# EAGLE board comando 24V (EAGLE 9.6.1), part 1 of 2
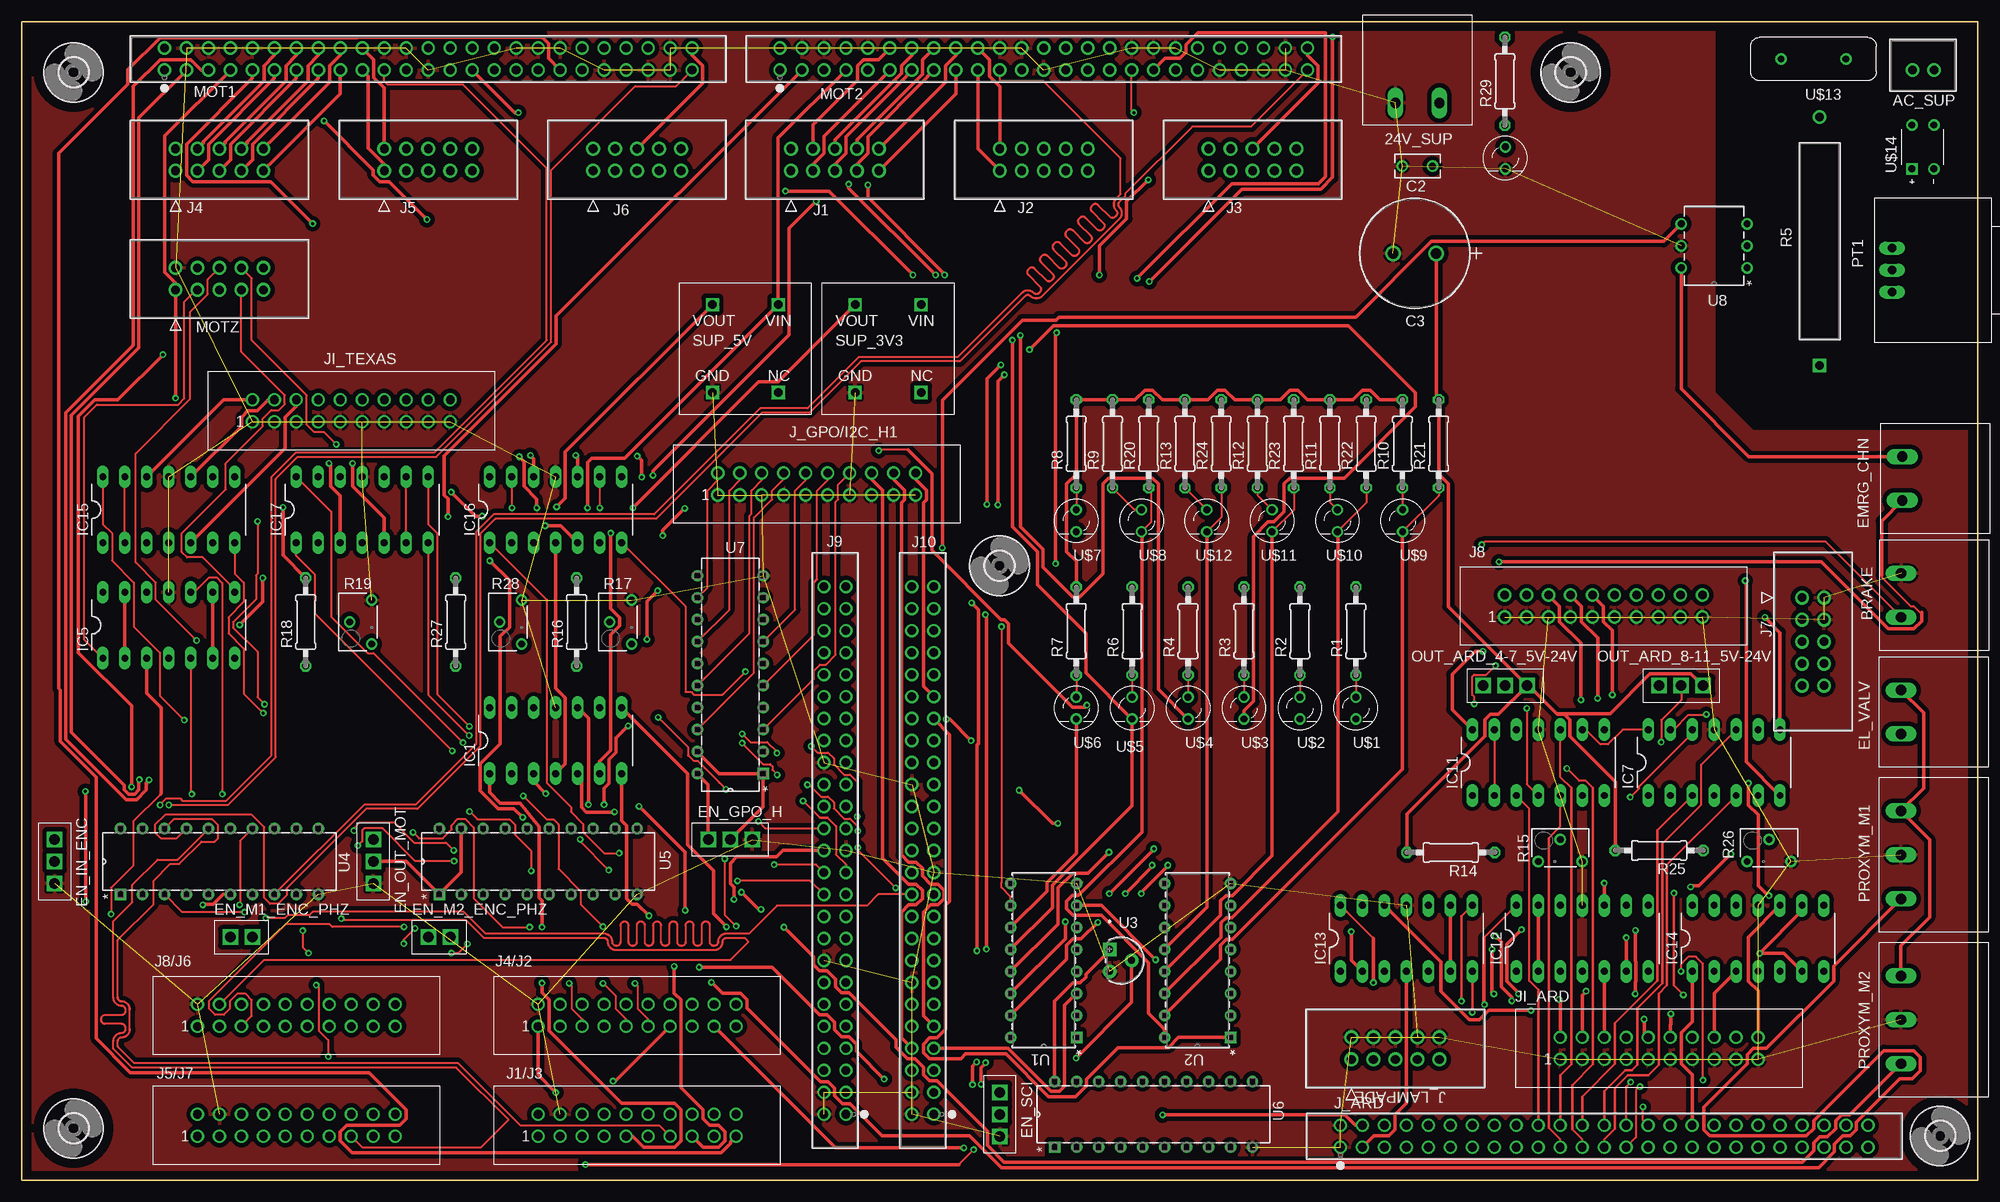
[diagram p13: board, top side]
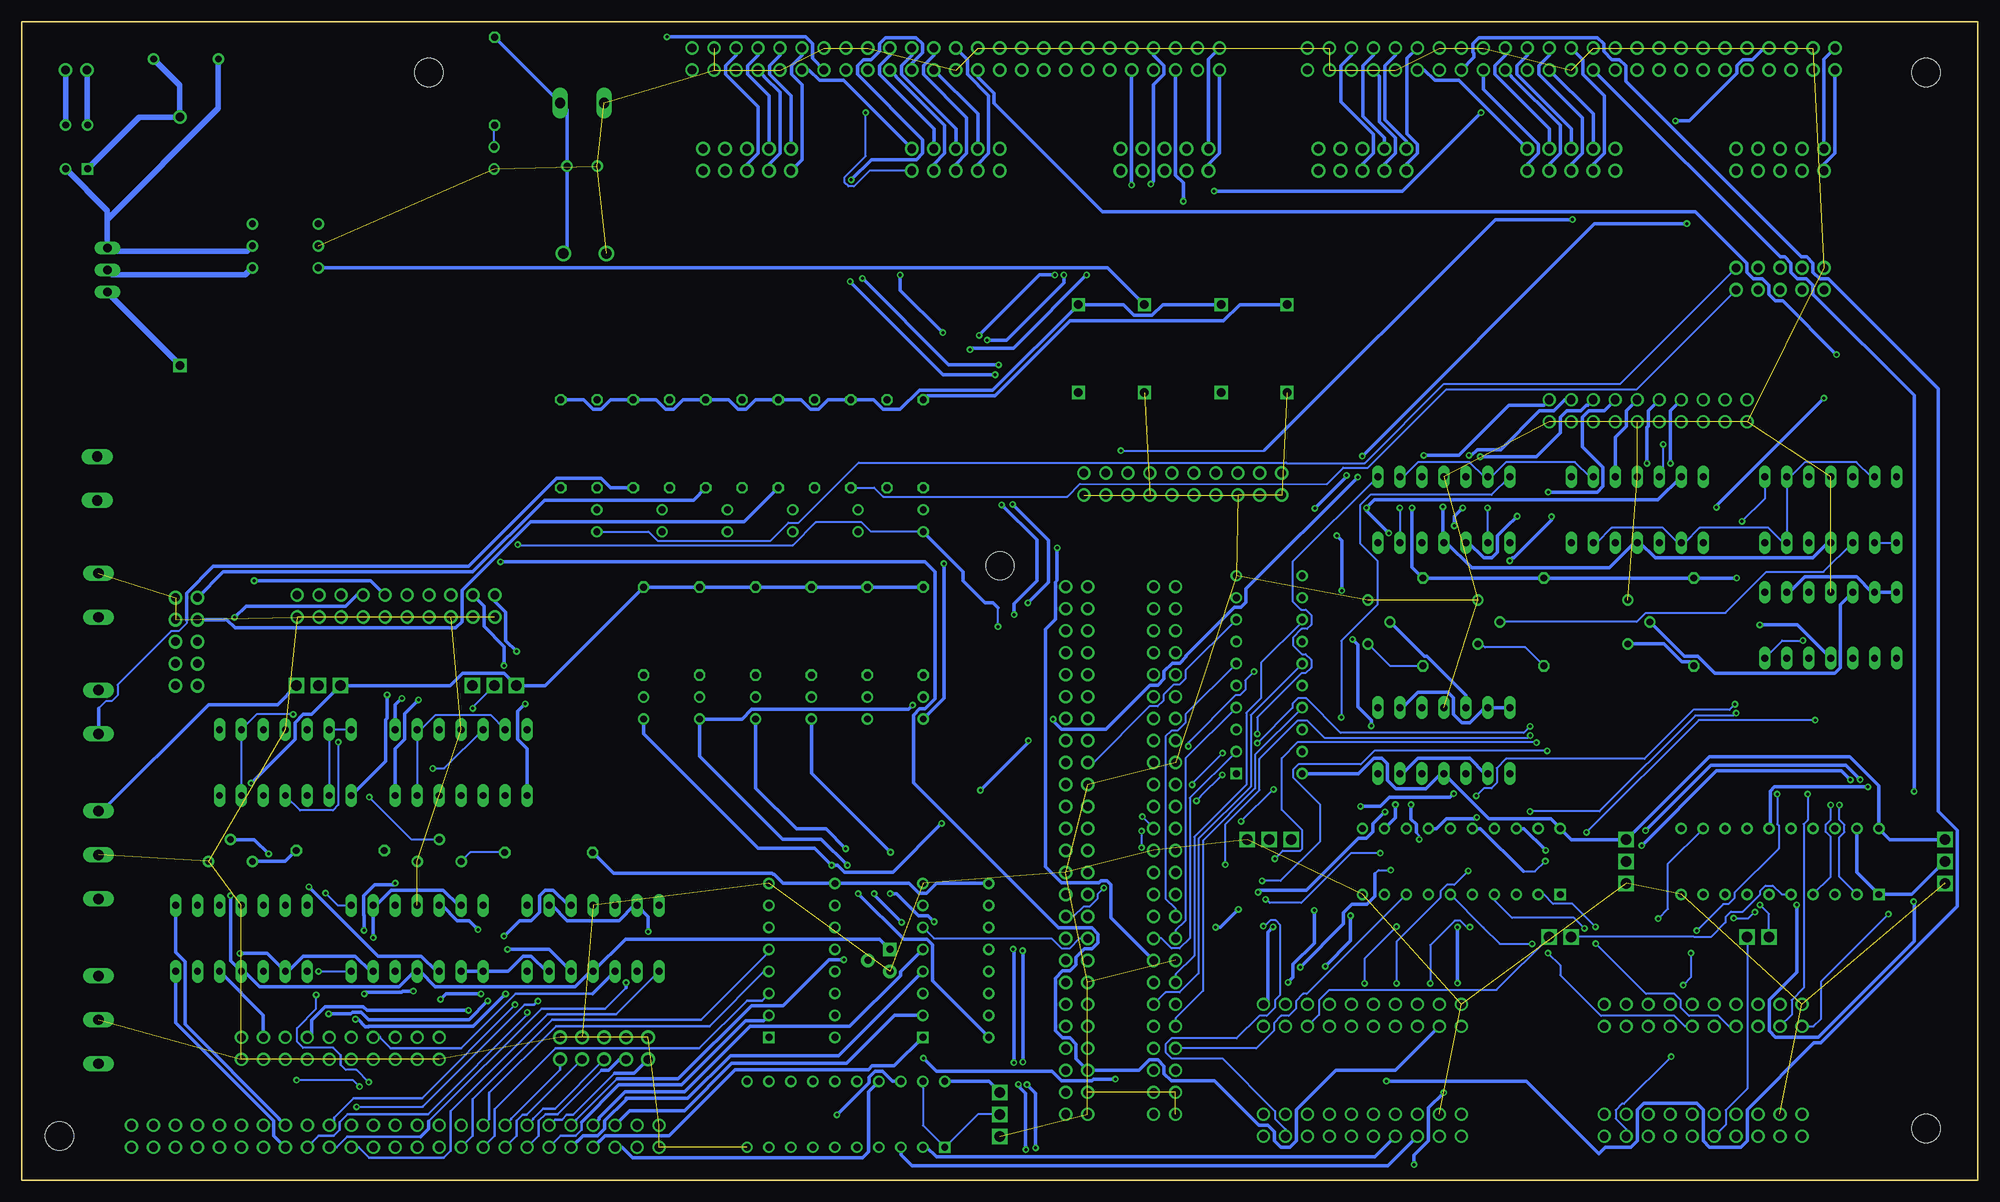
[diagram p14: board, bottom side, seen from below]

Size 226.06 x 133.86 mm. Coordinates in mm from the lower left corner, seen from the top.
Outline: 0,0 226.06,0 226.06,133.86 0,133.86 0,0
Copper layers (1*16): Top 0.035mm / dielectric 1.5mm / Bottom 0.035mm
Design rules "default *": minimum track width 10mil, minimum drill 0.35mm, track to track 10mil, track to pad 10mil, pad to pad 10mil, via to via 10mil, smd to smd 6mil, copper to edge 40mil, drill to drill 10mil, minimum pad ring 10mil, minimum via ring 8mil, stop-mask expansion 4mil, vias tented up to drill 0mil, thermal gap 10mil
Net classes: 0 default: width 0.254 mm, clearance 0.254 mm; 1 supply: width 0.381 mm, clearance 0.254 mm; 2 ground: width 0.381 mm, clearance 0.254 mm; 3 high speed: width 0.254 mm, clearance 0.254 mm; 4 mid speed: width 0.254 mm, clearance 0.254 mm

## Footprints (pad centres in the part's own frame; a part is rotated, then mirrored left to right if it is on the bottom)
CON_2F = drill 1.2 long: 1 0,0; 2 0,-5.08
CONN_B2B-XH-A(LF)(SN)_JST = drill 1 pad 1.549: 1 0,0; 2 -2.489,0
CAP_QYX_2P5X5X8P5_NCH = drill 0.8 pad 1.27: 1 0,0; 2 3.505,0
CAP_UBY_12P5X31P5_NCH = drill 1.2 pad 1.778: 1 0,0; 2 5.004,0
STRIP_3 = drill 1.2 square: 1 0,0; 2 2.54,0; 3 5.08,0
STRIP_2 = drill 1.2 square: 1 0,0; 2 2.54,0
DIL14 = drill 0.8 long: 1 -7.62,-3.81; 2 -5.08,-3.81; 3 -2.54,-3.81; 4 0,-3.81; 5 2.54,-3.81; 6 5.08,-3.81; 7 7.62,-3.81; 8 7.62,3.81; 9 5.08,3.81; 10 2.54,3.81; 11 0,3.81; 12 -2.54,3.81; 13 -5.08,3.81; 14 -7.62,3.81
CONN_61201021621_WRE = drill 1 pad 1.6: 1 0,0; 2 0,-2.54; 3 -2.54,0; 4 -2.54,-2.54; 5 -5.08,0; 6 -5.08,-2.54; 7 -7.62,0; 8 -7.62,-2.54; 9 -10.16,0; 10 -10.16,-2.54
61202021621 = drill 1: 1 -11.43,-1.27; 2 -8.89,-1.27; 3 -6.35,-1.27; 4 -3.81,-1.27; 5 -1.27,-1.27; 6 1.27,-1.27; 7 3.81,-1.27; 8 6.35,-1.27; 9 8.89,-1.27; 10 11.43,-1.27; 11 -11.43,1.27; 12 -8.89,1.27; 13 -6.35,1.27; 14 -3.81,1.27; 15 -1.27,1.27; 16 1.27,1.27; 17 3.81,1.27; 18 6.35,1.27; 19 8.89,1.27; 20 11.43,1.27
CONN_SBH11-PBPC-D25-ST-BK_SUL = drill 1 pad 1.524: 1 0,0; 2 0,2.54; 3 2.54,0; 4 2.54,2.54; 5 5.08,0; 6 5.08,2.54; 7 7.62,0; 8 7.62,2.54; 9 10.16,0; 10 10.16,2.54; 11 12.7,0; 12 12.7,2.54; 13 15.24,0; 14 15.24,2.54; 15 17.78,0; 16 17.78,2.54; 17 20.32,0; 18 20.32,2.54; 19 22.86,0; 20 22.86,2.54; 21 25.4,0; 22 25.4,2.54; 23 27.94,0; 24 27.94,2.54; 25 30.48,0; 26 30.48,2.54; 27 33.02,0; 28 33.02,2.54; 29 35.56,0; 30 35.56,2.54; 31 38.1,0; 32 38.1,2.54; 33 40.64,0; 34 40.64,2.54; 35 43.18,0; 36 43.18,2.54; 37 45.72,0; 38 45.72,2.54; 39 48.26,0; 40 48.26,2.54; 41 50.8,0; 42 50.8,2.54; 43 53.34,0; 44 53.34,2.54; 45 55.88,0; 46 55.88,2.54; 47 58.42,0; 48 58.42,2.54; 49 60.96,0; 50 60.96,2.54
CON_3F = drill 1.2 long: 1 0,0; 2 0,-5.08; 3 0,-10.16
POT_2W_5K = drill 1 long: 1 0,2.54; 2 0,0; 3 0,-2.54
0207/10 = drill 0.8 octagon: 1 -5.08,0; 2 5.08,0
RES_OY_OHM = drill 1 pad 1.549 square: 1 0,0 | drill 1 pad 1.549: 2 28.702,0
RES3_64W_TTE = drill 0.8 pad 1.219: 1 0,0; 2 2.54,2.54; 3 5.08,0
BR30X = drill 1 square: GND 0,-10.16; NC 7.62,-10.16; VIN 7.62,0; VOUT 0,0
DIP-16_STM = drill 0.8 pad 1.27 square: 1 0,0 | drill 0.8 pad 1.27: 2 0,-2.54; 3 0,-5.08; 4 0,-7.62; 5 0,-10.16; 6 0,-12.7; 7 0,-15.24; 8 0,-17.78; 9 7.62,-17.78; 10 7.62,-15.24; 11 7.62,-12.7; 12 7.62,-10.16; 13 7.62,-7.62; 14 7.62,-5.08; 15 7.62,-2.54; 16 7.62,0
T_3_ADI = drill 0.8 pad 1.524 square: 1 0,0 | drill 0.8 pad 1.524: 2 1.27,2.54; 3 2.54,0
N20 = drill 0.8 pad 1.295 square: 1 -7.62,22.86 | drill 0.8 pad 1.295: 2 -7.62,20.32; 3 -7.62,17.78; 4 -7.62,15.24; 5 -7.62,12.7; 6 -7.62,10.16; 7 -7.62,7.62; 8 -7.62,5.08; 9 -7.62,2.54; 10 -7.62,0; 11 0,0; 12 0,2.54; 13 0,5.08; 14 0,7.62; 15 0,10.16; 16 0,12.7; 17 0,15.24; 18 0,17.78; 19 0,20.32; 20 0,22.86
PDIP6-646BX_ONS = drill 0.8 pad 1.27: 1 0,0; 2 0,-2.54; 3 0,-5.08; 4 7.62,-5.08; 5 7.62,-2.54; 6 7.62,0
LED_TONDO = drill 0.8: 1 0,1.27; 2 0,-1.27
C0U12F = drill 0.8: P$1 0,0; P$2 7.5,0
DIP508W58P254L483H270Q4 = drill 0.8 square: 1 -2.54,1.27 | drill 0.8: 2 -2.54,-1.27; 3 2.54,-1.27; 4 2.54,1.27
3,3 = hole 3.3: 0,0

## Placement (x,y rotation side)
24V_SUP  CON_2F  [CON_2F]  163.83,124.46 270 top
AC_SUP  B2B-XH-A(LF)(SN)  [CONN_B2B-XH-A(LF)(SN)_JST]  220.98,128.27 0 top
BRAKE  CON_2F  [CON_2F]  217.2,65.05 180 top
C2  QYX1H102JTP3TA  [CAP_QYX_2P5X5X8P5_NCH]  163.04,117.17 180 top
C3  UBY2A301MHL  [CAP_UBY_12P5X31P5_NCH]  163.47,107.09 180 top
EL_VALV  CON_2F  [CON_2F]  217.17,51.56 180 top
EMRG_CHN  CON_2F  [CON_2F]  217.32,78.54 180 top
EN_GPO_H  STRIP_3  [STRIP_3]  79.35,39.37 0 top
EN_IN_ENC  STRIP_3  [STRIP_3]  3.81,39.37 270 top
EN_M1_ENC_PHZ  STRIP_2  [STRIP_2]  24.13,28.09 0 top
EN_M2_ENC_PHZ  STRIP_2  [STRIP_2]  46.99,28.09 0 top
EN_OUT_MOT  STRIP_3  [STRIP_3]  40.64,39.37 270 top
EN_SCI  STRIP_3  [STRIP_3]  113.03,10.16 270 top
IC1  LM324N  [DIL14]  61.72,50.8 0 top
IC5  LM324N  [DIL14]  17.02,64.14 0 top
IC7  LM324N  [DIL14]  195.58,48.26 0 top
IC11  LM324N  [DIL14]  175.26,48.26 0 top
IC12  LM324N  [DIL14]  180.34,27.94 0 top
IC13  LM324N  [DIL14]  160.02,27.94 0 top
IC14  LM324N  [DIL14]  200.66,27.94 0 top
IC15  LM324N  [DIL14]  17.02,77.47 0 top
IC16  LM324N  [DIL14]  61.72,77.47 0 top
IC17  LM324N  [DIL14]  39.37,77.47 0 top
J1  61201021621  [CONN_61201021621_WRE]  88.9,116.64 180 top
J1/J3  61202021621  [61202021621]  71.12,6.35 0 top
J2  61201021621  [CONN_61201021621_WRE]  113.03,116.64 180 top
J3  61201021621  [CONN_61201021621_WRE]  137.16,116.64 180 top
J4  61201021621  [CONN_61201021621_WRE]  17.78,116.64 180 top
J4/J2  61202021621  [61202021621]  71.12,19.05 0 top
J5  61201021621  [CONN_61201021621_WRE]  41.91,116.64 180 top
J5/J7  61202021621  [61202021621]  31.75,6.35 0 top
J6  61201021621  [CONN_61201021621_WRE]  66.04,116.64 180 top
J7  61201021621  [CONN_61201021621_WRE]  205.74,67.31 90 top
J8  61202021621  [61202021621]  182.8,66.34 0 top
J8/J6  61202021621  [61202021621]  31.75,19.05 0 top
J9  SBH11-PBPC-D25-ST-BK  [CONN_SBH11-PBPC-D25-ST-BK_SUL]  95.25,7.62 90 top
J10  SBH11-PBPC-D25-ST-BK  [CONN_SBH11-PBPC-D25-ST-BK_SUL]  105.41,7.62 90 top
J_ARD  SBH11-PBPC-D25-ST-BK  [CONN_SBH11-PBPC-D25-ST-BK_SUL]  152.4,3.81 0 top
J_GPO/I2C_H1  61202021621  [61202021621]  91.88,80.44 0 top
J_LAMPADE  61201021621  [CONN_61201021621_WRE]  153.67,13.97 180 top
JI_ARD  61202021621  [61202021621]  189.23,15.24 0 top
JI_TEXAS  61202021621  [61202021621]  38.1,88.9 0 top
MOT1  SBH11-PBPC-D25-ST-BK  [CONN_SBH11-PBPC-D25-ST-BK_SUL]  16.51,128.27 0 top
MOT2  SBH11-PBPC-D25-ST-BK  [CONN_SBH11-PBPC-D25-ST-BK_SUL]  87.63,128.27 0 top
MOTZ  61201021621  [CONN_61201021621_WRE]  17.78,102.87 180 top
OUT_ARD_4-7_5V-24V  STRIP_3  [STRIP_3]  168.91,57.15 0 top
OUT_ARD_8-11_5V-24V  STRIP_3  [STRIP_3]  189.23,57.15 0 top
PROXYM_M1  CON_3F  [CON_3F]  217.17,32.51 180 top
PROXYM_M2  CON_3F  [CON_3F]  217.17,13.46 180 top
PT1  POT_2W_5K  [POT_2W_5K]  216.15,105.16 0 top
R1  200R  [0207/10]  154.18,63.45 90 top
R2  200R  [0207/10]  147.72,63.45 90 top
R3  200R  [0207/10]  141.25,63.45 90 top
R4  200R  [0207/10]  134.79,63.45 90 top
R5  OY104KE  [RES_OY_OHM]  207.77,94.13 90 top
R6  200R  [0207/10]  128.33,63.45 90 top
R7  200R  [0207/10]  121.87,63.45 90 top
R8  200R  [0207/10]  121.87,85.09 90 top
R9  200R  [0207/10]  126.06,85.09 90 top
R10  200R  [0207/10]  159.57,85.09 90 top
R11  200R  [0207/10]  151.19,85.09 90 top
R12  200R  [0207/10]  142.81,85.09 90 top
R13  200R  [0207/10]  134.44,85.09 90 top
R14  22K  [0207/10]  165.15,37.87 180 top
R15  VS_5v_ADJ  [RES3_64W_TTE]  175.26,36.83 0 top
R16  22K  [0207/10]  64.13,64.5 90 top
R17  TEMP_ADJ  [RES3_64W_TTE]  70.48,61.96 90 top
R18  22K  [0207/10]  32.83,64.5 90 top
R19  VS_3V3_ADJ  [RES3_64W_TTE]  40.45,61.96 90 top
R20  3K  [0207/10]  130.25,85.09 90 top
R21  3K  [0207/10]  163.75,85.09 90 top
R22  3K  [0207/10]  155.38,85.09 90 top
R23  3K  [0207/10]  147,85.09 90 top
R24  3K  [0207/10]  138.62,85.09 90 top
R25  22K  [0207/10]  189.23,38.1 180 top
R26  VS_ARD_ADJ  [RES3_64W_TTE]  199.39,36.83 0 top
R27  22K  [0207/10]  50.16,64.5 90 top
R28  VS_EDGE_ADJ  [RES3_64W_TTE]  57.78,61.96 90 top
R29  2K  [0207/10]  171.4,126.97 90 top
SUP_3V3  BR30X  [BR30X]  96.33,101.17 0 top
SUP_5V  BR30X  [BR30X]  79.82,101.17 0 top
U1  ULN2003A  [DIP-16_STM]  121.92,16.51 180 top
U2  ULN2003A  [DIP-16_STM]  139.7,16.51 180 top
U3  TMP37FT9Z  [T_3_ADI]  125.73,26.67 270 top
U4  SN74LS244N  [N20]  34.29,40.64 90 top
U5  SN74LS244N  [N20]  71.12,40.64 90 top
U6  SN74LS244N  [N20]  142.24,11.43 90 top
U7  SN74LS244N  [N20]  78.08,69.85 180 top
U8  H11L1M  [PDIP6-646BX_ONS]  199.39,105.41 180 top
U$1  LED_TONDO  [LED_TONDO]  154.18,54.56 180 top
U$2  LED_TONDO  [LED_TONDO]  147.72,54.56 180 top
U$3  LED_TONDO  [LED_TONDO]  141.25,54.56 180 top
U$4  LED_TONDO  [LED_TONDO]  134.79,54.56 180 top
U$5  LED_TONDO  [LED_TONDO]  128.33,54.56 180 top
U$6  LED_TONDO  [LED_TONDO]  121.87,54.56 180 top
U$7  LED_TONDO  [LED_TONDO]  121.87,76.2 180 top
U$8  LED_TONDO  [LED_TONDO]  129.41,76.2 180 top
U$9  LED_TONDO  [LED_TONDO]  159.59,76.2 180 top
U$10  LED_TONDO  [LED_TONDO]  152.04,76.2 180 top
U$11  LED_TONDO  [LED_TONDO]  144.5,76.2 180 top
U$12  LED_TONDO  [LED_TONDO]  136.96,76.2 180 top
U$13  C0U12F  [C0U12F]  210.82,129.54 180 top
U$14  MB6M-E3/45  [DIP508W58P254L483H270Q4]  219.71,119.38 90 top
U$15  LED_ON  [LED_TONDO]  171.45,118.11 180 top
U$16  [3,3]  179,128 0 top
U$17  [3,3]  221.7,5.12 0 top
U$18  [3,3]  6,6 0 top
U$19  [3,3]  6,128 0 top
U$20  [3,3]  113,71 0 top

## Tracks (layer width: path | path; a pad name or v marks a point on that pad's centre or on a via)
220V_PROBE
  Bottom 0.61: PT1.2 215.59,104.6 200.2,104.6 U8.1
+3V3  (via drill 0.35)
  Top 0.381: SUP_3V3.VOUT 87.39,92.24 85.19,92.24 v70.64,77.69 | IC1.6 66.8,48.41 68.08,49.7 68.08,63.05 69.12,64.09 69.12,64.99 68.08,66.02 v68.08,74.78 | U8.6 191.77,91.47 199.62,83.62 EMRG_CHN.2
  Bottom 0.381: IC1.2 56.96,46.99 58.72,48.76 64.72,48.76 66.48,46.99 IC1.6 | SUP_3V3.VOUT 100.57,105.41 U8.6 | v68.08,74.78 70.64,77.33 v70.64,77.69 69.72,78.61 36.96,78.61 IC17.13
+5V  (via drill 0.35)
  Top 0.381: v201.92,32.89 201.82,32.89 200.66,34.05 200.66,42.23 199.56,43.33 v199.56,45.87 | IC13.4 160.02,8.89 158.69,7.56 158.69,5.85 157.98,5.14 156.27,5.14 J_ARD.3 | v61.82,77.79 62.83,78.79 62.83,84.18 SUP_5V.VOUT | IC1.4 62.83,48.09 62.83,55.73 61.72,56.83 IC16.4 | U7.20 79.35,45.72 EN_GPO_H.1 | U3.1 125.73,26.52 123,23.79 123,23.48 122.32,22.8 121.47,22.8 119.38,20.7 U6.20 | R7.2 121.87,71.53 120.77,72.64 120.77,80.47 121.87,81.57 R8.2 R9.2 128.68,90.17 129.79,91.28 130.71,91.28 131.81,90.17 R13.2 137.06,90.17 138.17,91.28 139.08,91.28 140.19,90.17 R12.2 145.44,90.17 146.54,91.28 147.46,91.28 148.56,90.17 R11.2 153.81,90.17 154.92,91.28 155.84,91.28 156.94,90.17 R10.2
  Bottom 0.381: v199.56,45.87 194.47,50.95 194.47,52.86 193.5,53.84 192.54,53.84 OUT_ARD_8-11_5V-24V.1 176.53,57.15 175.08,58.6 170.31,58.6 168.91,57.2 OUT_ARD_4-7_5V-24V.1 165.56,57.15 R1.2 R2.2 R3.2 R4.2 R6.2 R7.2 | v61.82,77.79 61.82,73.76 IC16.4 61.41,73.66 58.5,70.75 42.59,70.75 39.69,73.66 IC17.4 39.05,73.66 37.29,71.89 19.1,71.89 17.34,73.66 IC15.4 | U7.20 71.56,46.99 69.8,48.76 68.88,48.76 68.24,48.11 68.24,46.2 67.26,45.23 63.8,45.23 62.04,46.99 IC1.4 56.52,41.78 49.35,41.78 48.26,40.69 U5.20 46.99,39.37 EN_OUT_MOT.1 31.05,48.96 14.8,48.96 11.43,45.59 U4.20 10.16,39.37 EN_IN_ENC.1 | U6.20 114.3,11.43 EN_SCI.1 | U3.1 126.92,27.86 156.29,27.86 IC13.4 160.34,24.13 162.1,22.36 178.26,22.36 180.02,24.13 IC12.4 180.66,24.13 182.42,22.36 198.58,22.36 200.34,24.13 IC14.4 201.92,25.39 v201.92,32.89 | R8.2 121.4,90.64 113.58,90.64 104.94,99.28 87.16,99.28 85.28,101.17 SUP_5V.VOUT
+24V  (via drill 0.35)
  Top 0.381: MOT2.7 87.44,120.46 SUP_5V.VIN 69.68,83.41 65.86,83.41 65.38,82.93 v65.38,77.69 | v27.86,69.58 27.86,66.84 v25.2,64.17 | R18.2 30.2,72.21 v30.2,77.75 | v17.78,90.36 MOTZ.1 17.78,103.62 16.52,104.89 16.52,120.66 MOT1.7 | OUT_ARD_4-7_5V-24V.3 174.17,57.15 177.39,53.92 | 177.39,53.92 183.56,53.92 188.14,58.5 192.89,58.5 194.24,57.15 OUT_ARD_8-11_5V-24V.3 | 177.39,53.92 177.48,53.84 178.26,53.84 178.91,53.19 178.91,51.28 184.15,46.04 R25.2 | PROXYM_M2.3 217.17,27.08 220.5,30.4 220.5,39.34 PROXYM_M1.3 219.79,45.29 219.79,54.03 EL_VALV.2 | OUT_ARD_4-7_5V-24V.3 170.68,53.84 169.72,53.84 169.07,53.19 169.07,51.28 160.07,42.28 R14.2 | C3.1 163.47,90.45 R21.2 163.75,81.57 164.86,80.47 164.86,66.28 OUT_ARD_4-7_5V-24V.3
  Bottom 0.381: SUP_5V.VIN 94.19,101.17 95.42,99.94 97.5,99.94 98.72,101.17 SUP_3V3.VIN 113.84,91.28 122.33,91.28 124.54,89.06 126.52,89.06 127.62,90.17 R20.2 132.87,90.17 133.98,89.06 134.89,89.06 136,90.17 R24.2 141.25,90.17 142.35,89.06 143.27,89.06 144.38,90.17 R23.2 149.63,90.17 150.73,89.06 151.65,89.06 152.75,90.17 R22.2 158,90.17 159.11,89.06 160.02,89.06 161.13,90.17 R21.2 | v65.38,77.69 65.38,70.83 R16.2 R27.2 R18.2 v27.86,69.58 | IC5.4 20.87,64.17 v25.2,64.17 | PROXYM_M1.3 216.72,42.67 204.43,54.97 196.49,54.97 OUT_ARD_8-11_5V-24V.3 | U1.9 120.34,34.29 121.47,33.16 122.37,33.16 123.5,34.29 U2.9 138.05,34.29 139.1,35.34 139.23,35.34 139.25,35.37 139.35,35.47 157.67,35.47 R14.2 | C3.1 163.04,107.52 C2.1 163.04,123.67 24V_SUP.1 171.4,132.03 R29.2 | v17.78,90.36 30.2,77.94 v30.2,77.75
AC_IN1
  Bottom 0.61: AC_SUP.1 U$14.3
AC_IN2
  Bottom 0.381: 218.49,121.97 U$14.4
  Bottom 0.61: AC_SUP.2 218.49,121.97
GND  (125 unrouted)
  pour Top (isolate 0.508): 0.23,133.88 195.4,133.88 195.55,134.04 195.55,90.96 200.05,86.46 225.73,86.46 225.88,86.61 225.88,-0.15 0.15,-0.15 -0.23,0.23
GND_220V
  Bottom 0.61: U$14.2 216.15,112.01 PT1.1 | PT1.1 215.8,107.34 200,107.34 U8.2 | U$13.P$2 203.32,123.83 216.15,110.99 PT1.1
I/O_3V3_GPIO1
  Top 0.381: J_GPO/I2C_H1.20 103.31,80.97 104.58,79.7 104.58,78.64 104.2,78.27 104.2,57.09 J10.39
I/O_3V3_I2C_SCL
  Top 0.381: J_GPO/I2C_H1.18 98.23,80.97 99.5,79.7 99.5,37.22 102.5,34.23 103.37,34.23 104.08,33.52 104.08,32.52 103.37,31.81 102.5,31.81 101.66,30.98 101.66,16.45 J10.8
I/O_3V3_I2C_SDA
  Top 0.381: J_GPO/I2C_H1.19 100.77,80.97 102.04,79.7 102.04,78.64 101.66,78.27 101.66,37.6 102.5,36.77 103.37,36.77 104.08,36.06 104.08,35.19 105.04,34.23 105.91,34.23 106.62,33.52 106.62,32.52 105.91,31.81 105.04,31.81 104.2,30.98 104.2,18.99 J10.9
I/O_M1_1
  Bottom 0.381: J4.1 17.78,117.39 16.52,118.65 MOT1.1
I/O_M1_2
  Bottom 0.381: J4.2 17.78,129.54 MOT1.2
I/O_M1_11
  Top 0.381: J4.3 21.6,117.91 21.6,119.7 29.21,127.31 MOT1.11
I/O_M1_12
  Top 0.381: J4.4 20.96,119.82 20.96,119.96 28,127 28,128.77 29.21,129.98 MOT1.12
I/O_M1_13
  Top 0.381: J4.5 24.14,117.91 24.14,119.7 31.75,127.31 MOT1.13
I/O_M1_14
  Top 0.381: J4.6 23.5,119.82 23.5,119.96 30.54,127 30.54,128.77 31.75,129.98 MOT1.14
I/O_M1_15
  Top 0.381: J4.7 26.68,117.91 26.68,119.7 34.29,127.31 MOT1.15
I/O_M1_16
  Top 0.381: J4.8 26.04,119.82 26.04,119.96 33.08,127 33.08,128.77 34.29,129.98 MOT1.16
I/O_M1_17
  Top 0.381: J4.9 36.83,125.53 MOT1.17
I/O_M1_18
  Top 0.381: J4.10 35.62,126.86 35.62,128.77 36.83,129.98 MOT1.18
I/O_M1_19
  Top 0.381: MOT1.19 40.07,127.57 40.07,119.23 41.91,117.39 J5.1
I/O_M1_20
  Top 0.381: J5.2 41.91,126.19 40.7,127.4 40.7,129.48 MOT1.20
I/O_M1_26
  Bottom 0.381: J5.3 44.45,117.39 43.19,118.65 43.19,125.3 45.66,127.77 45.66,129.48 MOT1.26
I/O_M1_27
  Bottom 0.381: J5.4 44.45,123.19 MOT1.27
I/O_M1_28
  Bottom 0.381: J5.5 46.99,117.39 45.73,118.65 45.73,122.76 50.74,127.77 50.74,128.77 49.53,129.98 MOT1.28
I/O_M1_30
  Bottom 0.381: J5.6 46.99,121.48 53.28,127.77 53.28,128.77 52.07,129.98 MOT1.30
I/O_M1_31
  Bottom 0.381: MOT1.31 53.91,127.57 53.91,127.51 48.27,121.86 48.27,118.65 49.53,117.39 J5.7
I/O_M1_32
  Bottom 0.381: J5.8 49.53,121.48 55.82,127.77 55.82,128.77 54.61,129.98 MOT1.32
I/O_M1_33
  Bottom 0.381: MOT1.33 57.15,126.04 50.81,119.7 50.81,118.65 52.07,117.39 J5.9
I/O_M1_39
  Bottom 0.381: J5.10 59.96,127.06 62.73,127.06 63.94,128.27 MOT1.39
I/O_M1_40
  Bottom 0.381: J6.1 66.04,117.39 64.78,118.65 64.78,119.7 65.98,120.9 65.98,129.6 MOT1.40
I/O_M1_42
  Bottom 0.381: J6.2 66.04,120.07 68.52,122.54 68.52,128.77 67.31,129.98 MOT1.42
I/O_M1_43
  Bottom 0.381: MOT1.43 69.15,127.57 69.15,122.28 67.32,120.44 67.32,118.65 68.58,117.39 J6.3
I/O_M1_44
  Bottom 0.381: MOT1.44 69.85,129.98 71.06,128.77 71.06,122.95 68.58,120.47 J6.4
I/O_M1_46
  Bottom 0.381: J6.5 71.12,117.39 69.86,118.65 69.86,120.85 73.6,124.59 73.6,128.77 72.39,129.98 MOT1.46
I/O_M1_50
  Top 0.381: MOT1.50 77.47,129.98 78.68,128.77 78.68,126.73 J6.6
I/O_M2_1
  Bottom 0.381: J1.1 88.9,117.39 87.64,118.65 MOT2.1
I/O_M2_2
  Bottom 0.381: J1.2 88.9,129.54 MOT2.2
I/O_M2_11
  Top 0.381: J1.3 91.44,117.39 92.7,118.65 92.7,120.64 MOT2.11
I/O_M2_12
  Top 0.381: J1.4 91.44,121.92 96.58,127.06 96.58,128.77 97.29,129.48 99,129.48 MOT2.12
I/O_M2_13
  Top 0.381: MOT2.13 102.3,127.7 102.3,127.61 95.24,120.56 95.24,118.65 93.98,117.39 J1.5
I/O_M2_14
  Top 0.381: J1.6 93.98,120.19 101.66,127.88 101.66,128.77 102.87,129.98 MOT2.14
I/O_M2_15
  Top 0.381: MOT2.15 104.71,127.57 104.71,127.51 97.78,120.58 97.78,118.65 96.52,117.39 J1.7
I/O_M2_16
  Top 0.381: MOT2.16 104.08,129.48 104.08,127.77 96.52,120.21 J1.8
I/O_M2_17
  Top 0.381: J1.9 107.95,125.53 MOT2.17
I/O_M2_18
  Top 0.381: J1.10 106.74,126.86 106.74,128.77 107.95,129.98 MOT2.18
I/O_M2_19
  Top 0.381: J2.1 110.49,119.18 MOT2.19
I/O_M2_20
  Top 0.381: J2.2 113.03,126.34 111.82,127.55 111.82,129.48 MOT2.20
I/O_M2_26
  Bottom 0.381: J2.3 115.57,117.39 114.31,118.65 114.31,125.3 116.78,127.77 116.78,129.48 MOT2.26
I/O_M2_27
  Bottom 0.381: J2.4 115.57,123.19 MOT2.27
I/O_M2_28
  Bottom 0.381: J2.5 118.11,117.39 116.85,118.65 116.85,122.76 121.86,127.77 121.86,128.77 120.65,129.98 MOT2.28
I/O_M2_30
  Bottom 0.381: J2.6 118.11,121.48 124.4,127.77 124.4,128.77 123.19,129.98 MOT2.30
I/O_M2_31
  Bottom 0.381: MOT2.31 125.03,127.57 125.03,127.51 119.39,121.86 119.39,118.65 120.65,117.39 J2.7
I/O_M2_32
  Bottom 0.381: J2.8 120.65,121.48 126.94,127.77 126.94,128.77 125.73,129.98 MOT2.32
I/O_M2_33  (via drill 0.35)
  Top 0.254: v128.52,123.34 128.27,123.6 MOT2.33
  Bottom 0.254: J2.9 128.06,116.64 129.88,114.82 130.51,114.82 130.95,115.27 130.95,115.89 128.52,118.32 v128.52,123.34
I/O_M2_39
  Bottom 0.381: J2.10 131.08,127.06 133.85,127.06 135.06,128.27 MOT2.39
I/O_M2_40
  Bottom 0.381: MOT2.40 135.89,129.98 137.1,128.77 137.1,127.77 135.9,126.57 135.9,117.9 J3.1
I/O_M2_42
  Bottom 0.381: J3.2 137.16,125.29 139.64,127.77 139.64,128.77 138.43,129.98 MOT2.42
I/O_M2_43
  Bottom 0.381: MOT2.43 140.27,127.57 140.27,127.51 138.44,125.67 138.44,118.65 139.7,117.39 J3.3
I/O_M2_44
  Bottom 0.381: J3.4 139.7,125.29 142.18,127.77 142.18,128.77 140.97,129.98 MOT2.44
I/O_M2_46
  Bottom 0.381: J3.5 142.24,117.39 140.98,118.65 140.98,124.03 144.72,127.77 144.72,128.77 143.51,129.98 MOT2.46
I/O_M2_50
  Top 0.381: MOT2.50 148.59,129.98 149.8,128.77 149.8,126.73 J3.6
IN_3V3_220V_ALARM  (via drill 0.35)
  Top 0.381: U8.4 189.76,108.48 162.93,108.48 154.17,99.72 119.86,99.72 119.52,99.38 119.21,99.38 115.66,99.38 106.39,90.11 v106.39,73.06
  Bottom 0.381: J9.15 100.17,30.32 100.17,34.12 100.65,34.6 101.33,34.6 101.58,34.35 105.91,34.35 107.76,36.2 107.76,63.66 106.62,64.81 106.62,69.08 106.39,69.31 v106.39,73.06
IN_3V3_EDGE1  (via drill 0.35)
  Top 0.254: IC15.14 9.4,75.79 10.44,74.75 10.44,71.58 12.98,69.04 12.98,63.96 15.98,60.96 15.98,55.98 v18.8,53.16 | v45.24,40.19 45.92,39.51 48.66,39.51 49.7,40.54 49.7,41.04 50.4,41.74 51.23,41.74 52.23,40.74 52.23,32.57 55.56,29.25 v58.7,29.25 | v63.27,22.76 63.56,22.47 63.56,19.82 64.77,18.61 J4/J2.3
  Bottom 0.254: v18.8,53.16 32.27,53.16 v45.24,40.19 | v63.27,22.76 63.27,27.17 60.44,30 59.81,30 59.05,29.25 v58.7,29.25
IN_3V3_EDGE2  (via drill 0.35)
  Top 0.254: v28.06,55 27.25,55.8 27.25,61.04 24.44,63.86 24.44,64.49 27.1,67.15 27.1,69.89 27.25,70.05 v27.25,76.12 | v57.98,44.41 60.69,41.69 61.46,41.69 62.04,41.12 62.04,35.99 64.61,33.42 64.61,31.87 v67.18,29.3 | v70.87,22.75 71.18,22.44 71.18,19.82 72.39,18.61 J4/J2.6
  Bottom 0.254: IC15.8 24.64,78.74 v27.25,76.12 | v57.98,44.41 57.09,45.29 56.21,45.29 55.6,45.9 55.6,47.62 54.53,48.69 38.53,48.69 32.89,54.34 28.72,54.34 v28.06,55 | v67.18,29.3 70.87,25.61 v70.87,22.75
IN_3V3_EDGE3  (via drill 0.35)
  Top 0.254: IC15.7 24.64,70.08 25.68,69.04 25.68,66.82 23.91,65.05 23.91,63.19 25.68,61.42 25.68,56.23 v27.93,53.98 | v58.89,35.74 58.89,38.04 57.01,39.93 57.01,41.07 56.38,41.69 52.68,41.69 v51.77,42.61 | v67.18,22.76 68.64,21.3 68.64,19.82 69.85,18.61 J4/J2.5
  Bottom 0.254: v27.93,53.98 28.24,53.67 32.66,53.67 43.72,42.61 v51.77,42.61 | v67.18,22.76 67.18,27.57 62.09,32.67 62.09,33.4 61.36,34.12 60.51,34.12 v58.89,35.74
IN_3V3_EDGE4  (via drill 0.35)
  Top 0.254: J9.22 91.14,34.59 v82.73,34.59 | IC17.1 31.75,72.13 33.87,70.01 33.87,65.49 v49.76,49.61
  Bottom 0.254: v82.73,34.59 80.57,34.59 76.06,39.11 76.06,43.46 79.13,46.54 79.13,47.44 78.53,48.04 71.32,48.04 69.84,49.52 69.76,49.61 v49.76,49.61
IN_3V3_EDGE5  (via drill 0.35)
  Top 0.254: IC17.7 46.99,56.11 v51.72,51.38 | J9.24 91.8,36.47 v86.96,36.47
  Bottom 0.254: v51.72,51.38 51.97,51.13 75.53,51.13 77.53,53.12 78.56,53.12 83.01,48.67 83.01,45.06 86.96,41.11 v86.96,36.47
IN_3V3_EDGE6  (via drill 0.35)
  Top 0.254: IC17.8 46.99,75.79 48.03,74.75 48.03,56.14 v51.74,52.43 | v83.26,50.5 85.69,48.07 86.5,48.07 86.75,47.82 86.75,47.4 v87.31,46.85 | J9.23 95.25,36.48 94.11,37.63 94.11,40.91 | v90.3,43.84 v90.31,43.84
  Top 0.305: 94.11,40.91 93.11,41.91 92.24,41.91 v90.31,43.84
  Bottom 0.254: v51.74,52.43 52.48,51.7 73.64,51.7 77.6,55.66 78.58,55.66 79.18,55.06 79.18,54.58 v83.26,50.5 | v87.31,46.85 89.81,44.34 89.81,44.32 v90.3,43.84
IN_3V3_EDGE7  (via drill 0.35)
  Top 0.254: IC16.1 60.68,67.08 60.68,45.9 63.48,43.1 63.48,42.57 64.88,41.16 64.88,40.21 67.3,37.8 v69.05,37.8
  Top 0.381: J9.26 87.96,38.1 87.23,37.37 82.64,37.37 81.91,36.64 81.91,34.25 82.31,33.85 v82.31,32.45
  Bottom 0.254: v69.05,37.8 72.44,37.8 78.18,32.05 81.81,32.05 82.2,32.45 v82.31,32.45
IN_3V3_EDGE8  (via drill 0.35)
  Top 0.254: IC16.7 76.71,66.29 76.71,56.41 77.34,56.41 77.65,56.1 80.98,56.1 v83.64,58.76 | v91.24,50.14 91.98,49.4 93.18,49.4 93.85,48.73 93.85,48.04 95.03,46.86 95.72,46.86 96.56,46.03 v96.56,42.02
  Bottom 0.254: v83.64,58.76 84.64,57.75 84.64,56.65 85.25,56.05 85.77,56.05 91.24,50.58 v91.24,50.14 | v96.56,42.02 95.25,40.72 J9.27
IN_3V3_EDGE9  (via drill 0.35)
  Top 0.254: v73.56,53.48 77,50.04 77,49.1 77.65,48.45 78.1,48.45 80.63,45.92 v81.38,45.16 | v85.14,41.45 85.95,40.64 J9.28
  Bottom 0.254: IC16.14 56.2,79.18 70.22,79.18 71.4,78 71.4,73.58 69.39,71.57 69.39,66.5 73.56,62.33 v73.56,53.48 | v85.14,41.45 81.43,45.16 v81.38,45.16
IN_3V3_EDGE10  (via drill 0.35)
  Top 0.254: v100.99,33.78 100.99,33.8 96.58,38.21 96.62,38.25 96.64,38.27 v96.64,38.44 | v83.26,51.57 84.23,50.61 86.15,50.61 87.27,49.49 v87.27,49.35 | v96.64,40.34 96.64,40.86 95.72,41.78 95.03,41.78 93.85,42.96 93.85,43.65 93.18,44.32 92.36,44.32 90.99,45.7 v90.81,45.7
  Bottom 0.254: IC16.8 79.18,71.44 79.18,66.88 78.23,65.93 77.65,65.93 77.03,65.3 77.03,64.19 77.53,63.69 78.15,63.69 79.13,62.71 79.13,61.8 78.12,60.8 77.7,60.8 77.03,60.12 77.03,59.24 77.68,58.59 78.15,58.59 83.26,53.47 v83.26,51.57 | v100.99,33.78 101.73,33.04 101.73,32.55 102.65,31.62 103.34,31.62 104.49,30.48 J10.19 | v96.64,40.34 96.64,38.81 96.62,38.79 96.62,38.47 v96.64,38.44 | v87.27,49.35 90.81,45.82 v90.81,45.7
IN_3V3_EMRGN_CHN  (via drill 0.35)
  Top 0.254: 219.55,65.6 219.36,65.6 218.63,66.33 218.28,66.33 214.94,69.67 214.94,69.91
  Top 0.381: 219.55,65.6 219.55,64.58 218.67,63.7 215.72,63.7 207.98,71.44 v170.72,71.44 | EMRG_CHN.1 214.94,76.15 214.94,69.91
  Bottom 0.381: v170.72,71.44 121.65,71.44 120.52,70.31 120.52,55.62 121.68,54.47 122.3,54.47 123.02,53.74 123.02,45.93 106.24,29.15 102.37,29.15 101.66,28.44 101.66,27.44 102.37,26.73 103.24,26.73 104.2,25.77 104.2,24.9 104.91,24.19 105.78,24.19 106.62,23.36 106.62,17.28 105.78,16.45 104.91,16.45 104.2,15.74 104.2,14.03 J10.6 96.96,12.7 95.75,13.91 94.75,13.91 94.04,13.2 94.04,12.33 93.21,11.49 88.22,11.49 83.08,6.35 82.03,6.35 81.28,5.61 81.28,4.55 80.54,3.81 79.48,3.81 78.74,4.55 78.74,8.14 74.19,12.7 67.31,12.7 J4/J2.2
IN_3V3_HOMING_SENS_M1  (via drill 0.35)
  Top 0.381: v60.12,29.25 60.12,32.29 59.79,32.62 59.79,35.79 59.82,35.81 59.82,40.86 57.63,43.59 55.32,43.59 54.1,44.81 54.1,46.56 IC1.1 | v60.12,22.78 60.12,21.68 60.96,20.85 60.96,17.25 69.33,8.89 75.46,8.89 76.2,8.15 76.2,4.55 75.46,3.81 71.86,3.81 70.59,5.08 J1/J3.5
  Bottom 0.381: v60.12,29.25 v60.12,22.78
IN_3V3_HOMING_SENS_M2  (via drill 0.35)
  Top 0.381: IC1.7 69.34,41.55 69.93,40.97 69.93,32.54 70.57,31.9 71.15,31.9 v72.49,30.56 | v75.42,24.72 75.42,21.63 76.2,20.85 76.2,10.69 78.74,8.14 78.74,7.09 79.48,6.35 80.54,6.35 81.28,5.61 81.28,4.55 80.54,3.81 78.74,3.81 J1/J3.8
  Bottom 0.381: v72.49,30.56 72.49,27.64 v75.42,24.72
IN_3V3_M1_ALARM
  Top 0.381: J1/J3.10 81.92,4.45 81.92,4.29 80.8,3.17 38.21,3.17 36.83,4.55 36.83,5.61 37.57,6.35 43.7,6.35 44.45,7.09 44.45,8.15 40.15,12.45 12.57,12.45 8.64,16.38 8.64,46.55 4.48,50.7 4.48,56.6 4.27,56.82 4.27,118.63 12.28,126.64 12.28,128.29 16.01,132.02 28.71,132.02 38.75,132.02 38.79,132.06 60.15,132.06 60.9,131.31 60.9,129.6 MOT1.37
IN_3V3_M1_ENC_PH_N
  Top 0.254: J5/J7.8 39.37,3.81 53.09,3.81 56.26,6.99 50.23,13.02 12.81,13.02 10.6,15.22 10.6,16.07 arc-90 11.56,17.03 arc90 12,17.47 12,17.62 arc90 11.56,18.07 9.65,18.07 arc-90 9.21,18.51 9.21,18.67 arc-90 9.65,19.11 11.56,19.11 arc90 12,19.56 12,19.71 arc90 11.56,20.16 arc-90 10.6,21.11 10.6,29.93 12.8,32.13 12.8,34.14 15.72,37.06 18.01,37.06 U4.16
IN_3V3_M1_ENC_PH_P
  Top 0.254: J1/J3.7 73.66,6.35 57.61,6.35 50.44,13.53 13.02,13.53 11.11,15.43 11.11,16.07 arc-90 11.56,16.52 arc90 12.51,17.47 12.51,19.71 arc90 11.56,20.66 arc-90 11.11,21.11 11.11,27.77 15.24,31.9 15.24,34.54 15.21,34.57 17.2,36.55 18.22,36.55 20.78,39.12 22.3,39.12 22.7,39.51 22.7,41.02 22.02,41.69 17.56,41.69 U4.18
IN_3V3_M1_ENC_PHZ  (via drill 0.35)
  Top 0.254: v25.17,31.82 25.23,31.89 25.23,39.2 U4.14
  Bottom 0.254: EN_M1_ENC_PHZ.1 24.13,30.78 v25.17,31.82
IN_3V3_M1_READY  (via drill 0.35)
  Top 0.381: J4/J2.7 68.61,11.46 v68.35,11.46
  Bottom 0.381: v68.35,11.46 52.2,11.46 43.79,3.05 43.03,3.81 40.11,3.81 39.37,4.55 39.37,8.15 38.63,8.89 32.49,8.89 31.75,8.14 31.75,4.55 31.01,3.81 27.41,3.81 26.67,4.55 26.67,8.14 18.94,15.88 18.18,15.88 2.38,31.67 2.38,40.41 4.58,42.61 4.58,91.46 17.26,104.13 18.29,104.13 19.06,104.9 19.06,105.93 19.8,106.67 20.39,106.67 40.7,126.99 40.7,128.77 41.41,129.48 42.28,129.48 43.24,130.44 43.24,131.31 43.95,132.02 57.65,132.02 58.36,131.31 58.36,130.31 58.24,130.2 58.24,129.72 MOT1.35
IN_3V3_M2_ALARM  (via drill 0.35)
  Top 0.254: v110.01,3.54 108.3,1.83 108.3,1.8
  Top 0.381: J4/J2.1 59.69,12.17 v61.72,10.13 | 108.3,1.8 v65.15,1.8 | v110.89,11.07 110.89,13.03 111.19,13.32 111.19,13.37 v111.4,13.59 | v111.48,26.7 111.48,65.25 v111.37,65.35 | v112.8,78.03 112.8,92.3 v113.56,93.07 | v130.33,103.83 141,114.5 150.12,114.5 151.5,115.88 v151.5,132.1
  Bottom 0.254: 110.03,3.53 v110.01,3.54
  Bottom 0.381: v61.72,10.13 63.5,8.36 63.5,4.55 65.15,2.9 v65.15,1.8 | 110.03,3.53 110.03,10.03 110.7,10.71 110.7,10.98 110.8,11.07 v110.89,11.07 | v111.4,13.59 111.4,26.62 v111.48,26.7 | v111.37,65.35 111.37,66.61 108.75,69.24 108.75,73.97 v112.8,78.03 | v113.56,93.07 119.56,93.07 v130.33,103.83 | MOT2.37 134.68,129.6 134.68,131.31 135.48,132.1 v151.5,132.1
IN_3V3_M2_ENC_PH_N  (via drill 0.35)
  Top 0.254: J10.22 98.98,33.02 97.69,31.73 87.27,31.73 84.05,28.5 82.53,28.5 82.51,28.49 81.42,28.49 arc90 80.47,27.53 arc-90 80.03,27.09 79.98,27.09 arc-90 79.53,27.53 79.53,29.44 arc90 79.09,29.88 79.04,29.88 arc90 78.59,29.44 78.59,27.53 arc-90 78.15,27.09 78.1,27.09 arc-90 77.65,27.53 77.65,29.44 arc90 77.21,29.88 77.16,29.88 arc90 76.72,29.44 76.72,27.53 arc-90 76.27,27.09 76.22,27.09 arc-90 75.78,27.53 75.78,29.44 arc90 75.33,29.88 75.28,29.88 arc90 74.84,29.44 74.84,27.53 arc-90 74.39,27.09 74.34,27.09 arc-90 73.9,27.53 73.9,29.44 arc90 73.45,29.88 73.4,29.88 arc90 72.96,29.44 72.96,27.53 arc-90 72.51,27.09 72.46,27.09 arc-90 72.02,27.53 72.02,29.44 arc90 71.58,29.88 71.53,29.88 arc90 71.08,29.44 71.08,27.53 arc-90 70.64,27.09 70.58,27.09 arc-90 70.14,27.53 70.14,29.44 arc90 69.7,29.88 69.65,29.88 arc90 69.2,29.44 69.2,27.53 arc-90 68.76,27.09 68.71,27.09 arc-90 68.26,27.53 arc90 67.31,28.49 53.63,28.49 51.1,31.01 33.66,31.01 33.25,30.61 30.72,30.61 30.39,30.28 v28.22,30.28 | v25.76,30.98 18.55,30.98 U4.3
  Bottom 0.254: v25.76,30.98 25.68,31.06 25.68,31.11 26.52,30.28 v28.22,30.28
IN_3V3_M2_ENC_PH_P  (via drill 0.35)
  Top 0.254: J8/J6.12 28.02,25.48 81.94,25.48 84,27.53 84,27.56 83.59,27.96 82.6,27.96 82.59,27.98 81.42,27.98 arc90 80.98,27.53 arc-90 80.03,26.58 68.71,26.58 arc-90 67.75,27.53 arc90 67.31,27.98 53.42,27.98 51.35,30.05 36.93,30.05 v36.93,30.23
  Bottom 0.254: v36.93,30.23 35.81,31.35 35.81,36.58 U4.12
IN_3V3_M2_ENC_PHZ
  Bottom 0.254: EN_M2_ENC_PHZ.1 46.94,28.14 32.85,28.14 32.8,28.09 30.88,28.09 29.18,29.79 29.18,30.39 28.53,31.04 27.19,31.04 25.16,33.06 25.16,33.45 24.56,34.05 23.7,34.05 22.67,33.02 U4.5
IN_3V3_M2_READY  (via drill 0.35)
  Top 0.381: J4/J2.9 94.06,3.73 v108.89,3.73 | v109.88,11.05 109.88,13.18 v110.36,13.66 | v110.39,26.52 110.39,50.3 110.55,50.46 110.55,65.93 v109.78,66.7 | v111.53,78.08 111.53,92.58 v113.16,94.21 | v128.91,104.19 139.85,115.14 149.86,115.14 150.67,115.95 150.67,132.57 135.95,132.57 134.56,131.18 134.56,130.31 133.85,129.6 132.14,129.6 MOT2.35
  Bottom 0.381: v108.89,3.73 108.89,10.06 v109.88,11.05 | v110.36,13.66 110.36,26.49 v110.39,26.52 | v109.78,66.7 107.37,69.11 107.37,73.92 v111.53,78.08 | v113.16,94.21 118.92,94.21 v128.91,104.19
IN_3V3_MZ_ALARM  (via drill 0.35)
  Top 0.254: IC17.14 35.79,77.24 35.79,65.09 39.99,60.89 40.66,60.89 v51,50.55 | v81.25,37.15 81.25,30.69 v82.58,29.36
  Bottom 0.254: J1/J3.9 80.01,5.91 81.22,7.12 81.22,7.99 87.32,14.1 93.18,14.1 93.85,14.77 93.85,15.71 93.18,16.38 85.65,16.38 83.05,18.99 82.18,18.99 81.22,19.95 81.22,20.82 80.6,21.44 80.6,29.48 81.14,30.03 81.77,30.03 82.44,29.36 v82.58,29.36 | v51,50.55 51.04,50.58 78.63,50.58 80.44,48.78 80.44,42.79 78.07,40.43 78.07,38.31 78.29,38.09 80.31,38.09 v81.25,37.15
IN_3V3_SCI_RX
  Bottom 0.381: J1/J3.3 68.17,1.68 123.17,1.68 124.46,2.97 U6.3
IN_3V3_TEMP_ALARM  (via drill 0.35)
  Top 0.381: IC1.8 76.96,46.99 76.96,38.76 79.93,35.78 79.93,30.8 v81.46,29.27
  Bottom 0.381: v81.46,29.27 82.07,28.66 82.07,20.8 J4/J2.20
IN_5V_GPI1_0V-30V  (via drill 0.35)
  Top 0.254: IC12.14 168.99,28.02
  Top 0.381: 168.99,28.02 168.99,20.35 v169.04,20.3
  Bottom 0.305: J_ARD.32 189.93,6.92 189.93,7.21 187.67,9.47 179.8,9.47 169.01,20.26
  Bottom 0.381: 169.01,20.26 v169.04,20.3
IN_5V_GPI2_0V-30V  (via drill 0.35)
  Top 0.254: J_ARD.28 185.42,10.82 v185.94,11.34
  Top 0.305: v192.02,21.41 190.93,22.51 v190.93,33.16
  Bottom 0.254: 189.22,13.37 188.61,12.76 187.36,12.76 v185.94,11.34 | v192.02,21.41 192.02,19.8 194.25,17.58 194.25,16.01 193.54,15.3 190.05,15.3 | v190.93,33.16 189.51,31.75 IC12.8
  Bottom 0.305: 189.22,13.37 189.22,14.47 190.05,15.3
IN_5V_GPI3_0V-30V  (via drill 0.35)
  Top 0.254: v187.01,10.83 186.56,10.39 186.56,4.95 J_ARD.27 | v191.75,24.13 191.75,24.97 192.61,25.83 193.47,25.83 194.28,25.02 v194.28,11.58
  Bottom 0.254: v187.01,10.83 187.76,11.58 v194.28,11.58 | v191.75,24.13 191.72,24.11 187.99,24.11
  Bottom 0.305: IC12.7 187.99,24.11
IN_5V_GPI4_0V-30V
  Bottom 0.305: J_ARD.29 187.13,3.81 185.92,2.6 177.3,2.6 176.47,3.44 176.47,7.99 165.28,19.18 157.35,19.18 IC13.1
IN_5V_GPI5_0V-30V  (via drill 0.35)
  Top 0.305: v167.63,19.39 167.63,24.12 IC13.7
  Bottom 0.305: J_ARD.33 191.71,5.14 190,5.14 189.29,5.85 189.29,6.72 188.37,7.64 179.11,7.64 167.63,19.13
  Bottom 0.381: 167.63,19.13 v167.63,19.39
IN_5V_GPI6_0V-30V  (via drill 0.35)
  Top 0.254: J_ARD.30 187.36,6.95 v187.36,8.47 | IC13.8 166.4,30.5
  Top 0.305: 166.4,30.5 v166.4,20.7
  Bottom 0.254: v187.36,8.47 179.7,8.47
  Bottom 0.305: v166.4,20.7 166.84,20.25 167.92,20.25 179.7,8.47
IN_5V_GPI7_0V-30V  (via drill 0.35)
  Top 0.254: IC13.14 156.21,27.94
  Top 0.381: 156.21,27.94 v156.21,22.84
  Bottom 0.305: J_ARD.31 189.67,3.81 188.46,5.02 179.97,5.02 | 179.01,6.8 165.99,19.81 158.62,19.81 156.21,22.23
  Bottom 0.381: 179.97,5.02 179.01,5.98 179.01,6.8 | 156.21,22.23 v156.21,22.84
IN_5V_GPI8_0V-30V
  Top 0.381: J_ARD.34 193.04,12.18 191.77,13.44 191.77,17.04 193.04,18.3 IC14.1
IN_5V_GPI9_0V-30V
  Bottom 0.381: J_ARD.35 196.91,5.14 196.91,6.85 208.28,18.22 IC14.7
IN_5V_GPI10_0V-30V
  Bottom 0.381: J_ARD.36 196.28,7.05 196.28,7.11 207.18,18.01 207.18,25.25 208.28,26.35 IC14.8
IN_5V_M1_ENC_PH_N  (via drill 0.35)
  Top 0.254: MOT1.49 75.62,126.42 70.89,126.42 61.19,116.72 61.19,96.86 47.91,83.59 31.92,83.59 29.38,81.04 29.38,48.88 23.86,43.36 v17.02,43.36
  Bottom 0.254: U4.4 17.02,35.05 17.02,39.66 17.59,40.24 17.59,41.09 17.02,41.67 v17.02,43.36
IN_5V_M1_ENC_PH_P  (via drill 0.35)
  Top 0.254: v16,43.36 16,43.42 16.7,44.12 18.32,44.12 18.57,43.87 23.65,43.87 28.87,49.09 28.87,81.25 31.71,84.09 47.7,84.09 60.68,97.08 60.68,116.93 51.01,126.59 42.32,126.59 41.91,127 MOT1.21
  Bottom 0.254: U4.2 16,35.05 16,39.64 15.43,40.21 15.43,41.07 16,41.64 v16,43.36
IN_5V_M1_ENC_PHZ  (via drill 0.35)
  Top 0.381: U4.6 23.29,33.02 22.14,31.88 20.98,31.88 v20.93,31.82 | v7.42,32.18 7.42,44.88 v7.37,44.93
  Bottom 0.381: v20.93,31.82 20.93,24.05 24.13,20.85 24.13,17.25 23.39,16.51 18.44,16.51 7.33,27.61 7.33,32.1 v7.42,32.18 | MOT1.23 22.85,106.67 22.34,106.67 21.6,105.93 21.6,104.9 20.84,104.15 19.81,104.15 19.06,103.39 19.06,102.36 7.42,90.72 7.37,90.67 v7.37,44.93
IN_5V_M2_ENC_PH_N
  Top 0.254: U4.17 17.95,39.53 16.08,39.53 15.4,40.21 15.4,41.07 16.59,42.25 26.56,42.25 28.03,40.79 28.03,32.62 28.71,31.94 29.64,31.94 30.62,32.92 30.62,33.72 39.8,42.9 45.75,42.9 53.01,50.16 53.01,74.7 54.73,76.42 73.3,76.42 85.55,88.67 91.04,88.67 96.98,94.61 108.15,94.61 | MOT2.49 142.06,121.74 135.28,121.74 127.51,113.97 127.51,113.71 126.84,113.04 arc90 126.84,112.41 arc-90 126.84,111.07 117.93,102.16 arc-90 116.58,102.16 arc90 115.95,102.16 108.41,94.61 108.15,94.61 | 108.15,94.61
IN_5V_M2_ENC_PH_P
  Top 0.254: U4.8 39.59,43.4 45.54,43.4 52.5,50.37 52.5,74.91 54.52,76.93 73.09,76.93 85.34,89.18 90.83,89.18 96.77,95.12 108.2,95.12 115.59,102.51 arc-90 116.94,102.51 arc90 117.57,102.51 117.68,102.62 arc90 117.68,103.25 116.33,104.59 arc-90 116.33,105.22 116.43,105.33 arc-90 117.06,105.33 118.41,103.98 arc90 119.04,103.98 119.14,104.09 arc90 119.14,104.72 117.8,106.06 arc-90 117.8,106.69 117.9,106.8 arc-90 118.53,106.8 119.88,105.45 arc90 120.51,105.45 120.61,105.56 arc90 120.61,106.18 119.26,107.53 arc-90 119.26,108.16 119.37,108.26 arc-90 120,108.26 121.34,106.92 arc90 121.97,106.92 122.08,107.02 arc90 122.08,107.65 120.73,109 arc-90 120.73,109.63 120.84,109.73 arc-90 121.47,109.73 122.81,108.39 arc90 123.44,108.39 123.55,108.49 arc90 123.55,109.12 122.2,110.47 arc-90 122.2,111.09 122.31,111.2 arc-90 122.93,111.2 124.28,109.85 arc90 124.91,109.85 125.01,109.96 arc90 125.01,110.59 123.67,111.93 arc-90 123.67,112.56 123.77,112.67 arc-90 124.4,112.67 125.75,111.32 arc90 126.38,111.32 126.48,111.42 arc90 126.48,112.05 arc-90 126.48,113.4 127,113.92 127,118.06 118.08,126.97 113.21,126.97 113.03,127.15 MOT2.21
IN_5V_M2_ENC_PHZ  (via drill 0.35)
  Top 0.381: v16.33,95.38 11.13,90.17 8.44,90.17 6.54,88.27 6.54,60.96 12.7,54.8 v12.7,45.44
  Bottom 0.381: v12.7,45.44 16.92,45.44 16.93,45.45 23.53,45.45 24.01,44.97 24.01,40.76 U4.15 | v16.33,95.38 22.56,101.61 23.38,101.61 24.14,102.36 24.14,103.39 24.89,104.15 25.92,104.15 26.68,104.9 26.68,105.93 32.66,111.91 101.17,111.91 113.67,124.42 113.67,125.56 115.57,127.46 MOT2.23
IN_5V_RX  (via drill 0.35)
  Top 0.381: J_ARD.4 154.11,6.35 152.9,7.56 v131.84,7.56
  Bottom 0.381: U6.18 125.41,11.43 126.55,12.57 127.45,12.57 128.12,11.91 128.12,11.28 v131.84,7.56
IN_24V_HOMING_SENS_M1  (via drill 0.35)
  Top 0.381: PROXYM_M1.1 209.38,24.73 209.38,23.01 201.61,15.24 200.13,15.24 199.39,14.49 199.39,13.44 194.37,8.43 194.37,5.85 195.08,5.14 206.24,5.14 207.07,5.98 207.07,6.85 215.19,14.96 218.67,14.96 219.43,14.21 219.43,12.63 218.5,11.71 217.01,11.71 212.03,6.72 212.03,5.85 211.32,5.14 210.45,5.14 209.49,4.18 209.49,3.31 207.65,1.47 113.25,1.47 109.56,5.16 99.42,5.16 95.75,8.83 94.88,8.83 93.92,9.79 93.92,10.66 93.21,11.37 92.34,11.37 83.82,19.88 83.82,20.85 83.08,21.59 80.98,21.59 v79.7,22.86 | v76.68,31.19 76.68,37.87 v71.35,43.2 | v60.58,44.68 59.18,46.08 IC1.3
  Bottom 0.381: v79.7,22.86 79.13,23.43 79.13,24.95 76.68,27.4 v76.68,31.19 | v71.35,43.2 69.05,43.2 68.02,44.23 61.03,44.23 v60.58,44.68
IN_24V_HOMING_SENS_M2  (via drill 0.35)
  Top 0.381: IC1.5 64.68,46.57 64.68,43.07 65.24,42.51 68.46,42.51 v68.52,42.57 | v83.19,33.27 85.17,31.29 v85.45,31.29 | v88.09,29.23 91.5,25.82 91.5,24.9 92.21,24.19 93.08,24.19 94.04,23.23 94.04,22.36 94.75,21.65 95.62,21.65 101.03,16.25 101.03,15.38 102.37,14.03 103.24,14.03 104.2,13.07 104.2,12.2 104.91,11.49 105.78,11.49 111.6,5.67 111.6,4.04 113.53,2.11 205.74,2.11 207.07,3.44 207.07,4.31 207.78,5.02 208.65,5.02 209.61,5.98 209.61,6.85 210.32,7.56 211.26,7.56 PROXYM_M2.1
  Bottom 0.381: v68.52,42.57 69.9,41.19 69.9,40.26 70.67,39.5 71.59,39.5 77.6,33.49 82.97,33.49 v83.19,33.27 | v85.45,31.29 87.5,29.23 v88.09,29.23
IN_24V_MZ_ALARM  (via drill 0.35)
  Top 0.254: v36.36,85.01 34.95,86.42 33.79,86.42 32.96,87.26 32.96,90.67 26.6,97.03 26.6,104.21 MOTZ.8
  Bottom 0.254: IC17.12 36.36,81.75 v36.36,85.01
IN_30V_EDGE1
  Top 0.381: IC15.12 23.37,90.17 JI_TEXAS.11
IN_30V_EDGE2
  Top 0.381: IC15.10 25.4,87.12 25.4,88.16 26.14,88.9 27.2,88.9 28.46,90.17 JI_TEXAS.12
IN_30V_EDGE3
  Top 0.381: JI_TEXAS.13 31.75,89.42 30.48,88.16 30.48,84.58 IC15.5
IN_30V_EDGE4  (via drill 0.35)
  Top 0.381: IC17.3 36.83,79.06 35.73,80.16 35.73,82.64 v35.53,82.83
  Bottom 0.381: v35.53,82.83 35.53,87.08 35.56,87.1 35.56,88.9 JI_TEXAS.14
IN_30V_EDGE5  (via drill 0.35)
  Top 0.381: v38.23,82.83 38.27,82.79 38.27,80.16 41.91,76.52 IC17.5
  Bottom 0.381: v38.23,82.83 38.23,86.98 38.1,87.1 38.1,88.9 JI_TEXAS.15
IN_30V_EDGE6
  Bottom 0.381: IC17.10 41.91,85.83 40.64,87.1 40.64,88.9 JI_TEXAS.16
IN_30V_EDGE7  (via drill 0.35)
  Top 0.381: v49.66,79.5 52.44,76.72 v53.23,76.72
  Bottom 0.381: JI_TEXAS.17 43.18,88.9 44.98,88.9 45.72,88.16 45.72,84.77 43.34,82.4 43.34,80.16 43.99,79.52 49.64,79.52 v49.66,79.5 | v53.23,76.72 54.52,75.42 54.56,75.42 55.54,74.45 55.54,72.54 56.18,71.89 57.1,71.89 58.87,73.66 IC16.3
IN_30V_EDGE8  (via drill 0.35)
  Top 0.381: v57.51,83.59 58.08,83.02 58.08,80.16 59.54,78.7 v59.54,77.69 | v60.5,75.62 62.31,75.62 IC16.5
  Bottom 0.381: v57.51,83.59 51.03,83.59 48.26,86.36 48.26,88.16 47.52,88.9 45.87,88.9 45.24,89.53 45.09,89.53 JI_TEXAS.18 | v59.54,77.69 60.5,76.72 v60.5,75.62
IN_30V_EDGE9  (via drill 0.35)
  Top 0.381: v58.8,83.74 59.18,83.36 IC16.12
  Bottom 0.381: JI_TEXAS.19 47.73,90.17 49,88.9 50.65,88.9 55.14,84.41 57.85,84.41 58.52,83.74 v58.8,83.74
IN_30V_EDGE10  (via drill 0.35)
  Top 0.381: v64.03,83.74 64.26,83.51 IC16.10
  Bottom 0.381: JI_TEXAS.20 50.16,89.53 54.17,89.53 59.96,83.74 v64.03,83.74
IN_30V_GPI1  (via drill 0.35)
  Top 0.381: JI_ARD.11 177.8,20.75 v177.65,20.9 | v173.33,28.96 173.3,28.96 171.62,27.27 171.62,23.01 172.97,21.66 v172.97,21.54
  Bottom 0.381: v177.65,20.9 177.01,21.54 v172.97,21.54 | v173.33,28.96 174.36,29.98 175.72,29.98 177.48,31.75 IC12.12
IN_30V_GPI2  (via drill 0.35)
  Top 0.381: JI_ARD.12 180.34,21.4 v180.79,21.84 | v186.47,21.54 186.47,22.96 186.53,23.01 186.53,25.25 186.49,25.29 v186.49,28.88 | v182.88,34.34 IC12.10
  Bottom 0.381: v180.79,21.84 182.04,21.84 182.16,21.73 186.28,21.73 v186.47,21.54 | v186.49,28.88 186.49,30.59 186.53,30.63 186.53,32.87 185.24,34.15 183.07,34.15 v182.88,34.34
IN_30V_GPI3
  Top 0.381: JI_ARD.13 IC12.5
IN_30V_GPI4
  Bottom 0.305: 184.68,16.51 183.41,15.24 175.27,15.24 168.99,21.52 160.09,21.52
  Bottom 0.381: JI_ARD.14 184.68,16.51 | 160.09,21.52 IC13.3
IN_30V_GPI5  (via drill 0.35)
  Top 0.381: JI_ARD.15 187.49,16.98 v187.49,18.6 | v170.13,21.54 169.93,21.75 v169.93,26.67
  Bottom 0.381: v187.49,18.6 187.18,18.6 186.33,17.75 185.97,17.75 185.95,17.78 173.86,17.78 170.75,20.89 170.75,20.93 v170.13,21.54 | v169.93,26.67 165.1,26.67 IC13.5
IN_30V_GPI6  (via drill 0.35)
  Top 0.381: JI_ARD.16 190.5,17.97 190.58,18.05 v190.58,19.23 | v172.19,20.72 172.19,21.15 170.98,22.36 170.98,27.55 v170.33,28.2
  Bottom 0.381: v190.58,19.23 188.03,19.23 187.83,19.43 186.84,19.43 185.95,18.54 174.36,18.54 v172.19,20.72 | v170.33,28.2 168.54,29.98 167.18,29.98 166.21,30.96 166.21,32.87 165.56,33.52 164.64,33.52 162.88,31.75 IC13.10
IN_30V_GPI7  (via drill 0.35)
  Top 0.381: IC13.12 164,25.23 164,21.86 167.29,18.57 168.48,18.57 169.55,19.64 v174.43,19.64
  Bottom 0.381: v174.43,19.64 186.15,19.64 186.57,20.06 190.96,20.06 192.54,18.48 192.54,17.01 JI_ARD.17
IN_30V_GPI8
  Top 0.381: JI_ARD.18 195.58,21.59 IC14.3
IN_30V_GPI9
  Bottom 0.381: JI_ARD.19 198.12,19.05 IC14.5
IN_30V_GPI10
  Top 0.381: JI_ARD.20 200.66,21.91 199.56,23.01 199.56,28.11 IC14.10
N$1
  Top 0.254: R1.1 U$1.2
N$2
  Top 0.254: R2.1 U$2.2
N$3
  Top 0.254: R3.1 U$3.2
N$4
  Top 0.254: R4.1 U$4.2
N$5
  Top 0.254: R6.1 U$5.2
N$6
  Top 0.254: R7.1 U$6.2
N$7
  Top 0.254: R8.1 U$7.2
N$8
  Top 0.254: U$8.2 | U$8.2 128.6,77.47 R9.1
N$9
  Bottom 0.61: U$14.1 212.45,122.83 R5.2 207.77,126.49 U$13.P$1
N$10
  Top 0.254: R10.1 159.56,77.49 U$9.2
N$11
  Top 0.254: R11.1 151.19,78.33 U$10.2
N$12
  Top 0.254: R12.1 142.81,79.16 U$11.2
N$13
  Top 0.254: R13.1 134.44,79.99 U$12.2
N$14
  Bottom 0.254: R17.1 67.94,59.42 R16.1
N$15
  Bottom 0.381: R26.1 195.58,36.83 R25.1
N$16
  Top 0.381: EN_OUT_MOT.2 44.45,36.83 U5.1 50.8,35.56 U5.19
N$17
  Bottom 0.254: R28.1 57.36,61.96 56.96,61.55 52.29,61.55 R27.1
N$18
  Bottom 0.254: EN_SCI.2 115.57,7.62 U6.1 121.92,6.35 U6.19
N$19
  Top 0.381: EN_GPO_H.2 85.7,43.18 U7.1 80.62,46.99 U7.19
N$20
  Bottom 0.254: R14.1 174.22,37.87 R15.1
N$21
  Bottom 0.254: U$15.2 171.45,121.84 R29.1
N$22  (via drill 0.35)
  Top 0.254: v173.94,54.53 173.94,45.77 IC11.4
  Bottom 0.254: OUT_ARD_4-7_5V-24V.2 173.94,54.66 v173.94,54.53
N$23
  Bottom 0.61: PT1.3 207.77,94.23 R5.1
N$24
  Bottom 0.254: J4/J2.8 76.14,19.11 76.14,20.82 74.96,22 55.63,22 EN_M2_ENC_PHZ.2
N$25  (via drill 0.35)
  Top 0.381: v197.51,37.72 193.83,34.04 192.99,34.04 v192.86,33.91
  Bottom 0.381: R26.2 199.16,39.37 v197.51,37.72 | v192.86,33.91 184.85,25.89 179.88,25.89 178.12,24.13 IC12.3
N$26  (via drill 0.35)
  Top 0.254: 189.46,50.98 189.46,53.16 191.77,55.47 OUT_ARD_8-11_5V-24V.2 | 189.46,50.98 | 189.46,50.98 v189.46,50.62
  Bottom 0.254: 189.46,45.54 189.46,43.36 190.07,42.75 193.88,42.75 IC7.4 | 189.46,45.54 | v189.46,50.62 189.46,45.54
N$27  (via drill 0.35)
  Top 0.254: v185.88,44.27 186.92,45.31 186.92,45.54 193.04,51.66 IC7.12
  Bottom 0.254: R15.2 180.97,39.37 v185.88,44.27
N$28
  Bottom 0.254: J5/J7.5 29.15,6.41 29.15,8.12 26.67,10.6 EN_M1_ENC_PHZ.2
N$29
  Bottom 0.381: IC5.12 15.91,66.51 15.91,59.21 16.56,58.56 30.41,58.56 32.37,60.52 33.94,60.52 R19.2
N$31
  Bottom 0.381: R18.1 33.3,59.89 34.2,59.89 36.27,61.96 R19.1
N$32
  Bottom 0.381: R17.2 63.97,60.52 63.67,60.52 59.18,56.03 IC1.12
N$33
  Bottom 0.254: IC15.3 17.86,70.28 24.43,70.28 29.18,65.54 38.37,65.54 39.41,64.5 R28.2
N$43
  Bottom 0.381: EN_IN_ENC.2 7.62,33.02 U4.1 13.97,35.56 U4.19
OUT_3V3_GPO1_H
  Bottom 0.254: J10.34 102.21,48.26 95.73,54.74 94.78,54.74 94.11,55.41 94.11,56.1 92.93,57.28 92.24,57.28 91.57,57.95 91.57,58.9 U7.8
OUT_3V3_GPO2_H
  Bottom 0.254: U7.6 91.57,53.82 91.57,52.87 92.49,51.94 93.18,51.94 93.85,51.27 93.85,32.55 92.71,31.4 J9.20
OUT_3V3_GPO3_H
  Bottom 0.254: U7.4 91.57,48.74 91.57,30.01 92.71,28.86 J9.18
OUT_3V3_GPO4_H
  Bottom 0.254: U7.2 91.06,44.17 91.06,27.98 92.24,26.8 93.18,26.8 94.33,27.94 J9.17
OUT_3V3_GPO5_H
  Bottom 0.254: U7.13 78.08,64.54 82.83,59.79 82.83,55.7 84.53,54 84.53,45.7 90.55,39.67 90.55,25.94 92.71,23.78 J9.14
OUT_3V3_GPO6_H
  Bottom 0.254: U7.15 84.02,53.75 84.02,45.48 90.04,39.46 90.04,23.91 92.24,21.72 93.85,21.72 J9.11
OUT_3V3_GPO7_H
  Bottom 0.254: U7.17 83.52,49.17 83.52,45.27 89.53,39.25 89.53,21.88 92.71,18.7 J9.10
OUT_3V3_M1_CCW  (via drill 0.35)
  Top 0.254: v44.17,27.33 44.17,27.81 v45.47,29.11
  Bottom 0.254: v44.17,27.33 38.37,21.53 35.06,21.53 34.35,20.82 34.35,19.95 33.39,18.99 29.98,18.99 28.77,17.78 J8/J6.4 | v45.47,29.11 46.69,30.33 53.85,30.33 55.88,32.36 U5.4
OUT_3V3_M1_CW  (via drill 0.35)
  Top 0.254: v44.2,29.29 35.89,29.29 35.56,29.62 30.55,29.62 21.65,20.72 21.65,19.82 22.36,19.11 23.36,19.11 24.07,19.82 24.07,20.69 24.9,21.53 25.9,21.53 26.61,20.82 26.61,18.99 J8/J6.3
  Bottom 0.254: v44.2,29.29 46.85,31.94 49.09,31.94 50.17,33.02 U5.2
OUT_3V3_M1_RUN
  Top 0.381: J10.7 114,15.24 118.93,10.31 119.96,10.31 120.52,10.88 120.52,20.19 U1.3
OUT_3V3_M2_CCW
  Bottom 0.254: U5.8 77.53,21.53 77.97,21.53 78.8,20.69 78.8,19.82 79.64,18.99 80.51,18.99 81.34,18.15 81.34,17.28 83.38,15.24 J9.8
OUT_3V3_M2_CW  (via drill 0.35)
  Top 0.254: v51.51,27.3 50.44,26.23 v49.68,26.23
  Bottom 0.254: J8/J6.6 33.85,17.78 35.06,18.99 43.55,18.99 48.27,23.7 48.27,24.82 v49.68,26.23 | U5.6 57.12,29.18 55.24,27.3 v51.51,27.3
OUT_3V3_M2_RUN
  Bottom 0.254: U1.6 120.65,27.94 107.03,27.94 105.88,26.8 104.94,26.8 103.79,27.94 J10.18
OUT_3V3_MZ_DIR  (via drill 0.35)
  Top 0.254: v23.19,44.62 23.19,68.99 22.53,69.65 21.67,69.65 19.96,67.94 IC5.10 | v32.49,28.85 32.49,26.9 v33.15,26.23 | v34.06,22.55 34.35,22.26 34.35,17.28 35.43,16.2 v35.43,14.29
  Bottom 0.254: v23.19,44.62 23.19,41.16 23.02,40.99 23.02,38.31 28.13,33.21 28.13,32.59 28.81,31.91 29.42,31.91 v32.49,28.85 | v33.15,26.23 33.15,23.47 v34.06,22.55 | J5/J7.9 40.64,5.91 41.85,7.12 41.85,8.12 41.14,8.83 40.89,8.83 v35.43,14.29
OUT_3V3_MZ_EN
  Top 0.381: U2.1 133.68,16.51 132.5,15.33 126.71,15.33 123.04,11.65 123.04,10.93 121.79,9.68 118.67,9.68 113.75,14.59 109.09,14.59 108.53,14.03 104.91,14.03 104.2,14.74 104.2,15.74 104.91,16.45 105.78,16.45 106.76,17.42 106.76,31.76 107.25,32.26 107.25,51.5 J10.37
OUT_3V3_MZ_IMP  (via drill 0.35)
  Top 0.254: IC5.5 19.56,44.73 v19.66,44.62
  Bottom 0.254: v19.66,44.62 19.66,41.61 20.13,41.14 20.13,22.22 21.53,20.82 21.53,19.11 J8/J6.2
OUT_3V3_MZ_TRIGGER  (via drill 0.35)
  Top 0.254: v10.33,30.74 10.35,30.75 10.35,33.8 12.92,36.37 12.92,41.47 16.05,44.61
  Top 0.381: IC5.3 14.48,56.26 16.13,54.61 16.13,44.69 16.05,44.61
  Bottom 0.254: v10.33,30.74 18.15,22.92 18.15,18.63 19,17.78 J8/J6.1
OUT_3V3_SCI_TX
  Bottom 0.381: U6.2 121.48,3.81 120.36,2.69 69.7,2.69 J1/J3.4
OUT_5V_ELVALV_24V
  Bottom 0.305: J_ARD.17 171.39,5.14 171.39,8.2 164.35,15.24 147.78,15.24 142.25,20.77 140.53,20.77 U2.3
OUT_5V_GPO1_24V
  Bottom 0.305: J_ARD.18 172.02,7.05 172.02,10.11 164.32,17.8 146.58,17.8 140.26,24.13 U2.4
OUT_5V_GPO1_H
  Top 0.254: J_GPO/I2C_H1.11 80.45,80.88 79.24,79.67 79.24,68.47 U7.12
OUT_5V_GPO2_24V
  Bottom 0.305: J_ARD.19 173.93,5.14 173.93,9.38 164.76,18.54 147.55,18.54 139.7,26.39
  Bottom 0.381: 139.7,26.39 U2.5
OUT_5V_GPO2_H
  Top 0.254: J_GPO/I2C_H1.12 82.99,80.88 81.78,79.67 81.78,65.93 U7.14
OUT_5V_GPO3_H
  Top 0.254: U7.16 84.1,63.17 84.1,76.75 84.32,76.98 84.32,79.67 85.53,80.88 J_GPO/I2C_H1.13
OUT_5V_GPO4_24V-5V  (via drill 0.35)
  Top 0.254: v178.56,47.57 179.98,46.15 180.77,46.15 181.6,45.33 | J_ARD.23 180.34,4.73 179.17,5.9
  Top 0.305: 179.17,5.9 179.17,10.99 181.6,13.42 181.6,45.33
  Bottom 0.254: v178.56,47.57 177.22,47.57 IC11.12
OUT_5V_GPO4_H
  Top 0.254: U7.18 84.63,58.62 84.63,76.57 86.74,78.67 86.74,79.67 88.07,81.01 J_GPO/I2C_H1.14
OUT_5V_GPO5_24V-5V
  Top 0.254: 175.26,22 174.22,23.04 174.22,42.95 IC11.3
  Top 0.305: J_ARD.20 175.26,22
OUT_5V_GPO5_H
  Top 0.254: J_GPO/I2C_H1.15 90.61,80.88 89.4,79.67 89.4,65.93 U7.7
OUT_5V_GPO6_24V-5V
  Top 0.254: J_ARD.21 177.8,4.73 176.47,6.07 | IC11.5 177.8,40.87 177.07,40.15 176.47,39.54
  Top 0.305: 176.47,6.07 176.47,39.54
OUT_5V_GPO6_H
  Top 0.254: U7.5 91.57,63.02 91.57,69.05 91.94,69.43 91.94,79.67 93.15,80.88 J_GPO/I2C_H1.16
OUT_5V_GPO7_24V-5V
  Top 0.254: IC11.10 177.8,46.58 179.06,45.33
  Top 0.305: J_ARD.22 177.8,12.16 179.06,13.42 179.06,45.33
OUT_5V_GPO7_H
  Top 0.254: U7.3 91.57,57.94 91.57,58.89 92.24,59.56 92.93,59.56 94.08,60.72 94.08,78.4 94.36,78.67 94.36,80.38 J_GPO/I2C_H1.17
OUT_5V_GPO8_24V-5V
  Top 0.254: 184.14,18.14 189.03,23.03 | 189.03,40.44 IC7.3
  Top 0.305: 189.03,23.03 189.03,40.44 | 184.14,18.14 184.14,13.45 180.34,9.65 J_ARD.24
OUT_5V_GPO9_24V-5V
  Top 0.254: 190.14,36.47 IC7.5 | J_ARD.25 182.88,4.73 184.12,5.98
  Top 0.305: 190.14,36.47 190.14,22.53 189.19,21.58 189.19,13.37 187.95,12.13 185.6,12.13 184.12,10.65 184.12,5.98
OUT_5V_GPO10_24V-5V
  Top 0.254: IC7.10 194.08,48.03 194.08,43.36 189.59,38.86
  Top 0.305: J_ARD.26 182.88,10.28 185.31,12.71 186.05,12.71 186.7,13.37 186.7,19.88 189.59,22.77 189.59,38.86
OUT_5V_LAMPADA_1
  Bottom 0.305: J_ARD.12 164.44,7.01 163.61,7.01 163.06,7.56 162.32,7.56 157.53,12.34
  Bottom 0.381: J_LAMPADE.1 155.3,12.34 157.53,12.34
OUT_5V_LAMPADA_2
  Bottom 0.305: J_ARD.13 166.31,5.14 166.31,6.85 165.51,7.64 164.11,7.64 159.05,12.71
  Bottom 0.381: 159.05,12.71 158.23,12.71 156.96,13.97 J_LAMPADE.3
OUT_5V_LAMPADA_3
  Bottom 0.305: J_ARD.14 166.94,7.05 166.94,7.11 165.77,8.28 164.44,8.28 J_LAMPADE.5
OUT_5V_LAMPADA_4
  Bottom 0.305: J_ARD.15 168.85,5.14 168.85,6.85 168.14,7.56 167.7,7.56 J_LAMPADE.7
OUT_5V_LAMPADA_5
  Bottom 0.305: J_ARD.16 169.48,7.05 169.48,7.11 163.83,12.76 J_LAMPADE.9
OUT_5V_M1_CCW  (via drill 0.35)
  Top 0.254: v49.98,36.88 45.47,36.88 41.7,40.65 39.58,40.65 39.36,40.43 39.36,39.17 v38.86,38.66
  Top 0.381: MOT1.5 20.76,128.27 19.55,129.48 16.01,129.48 12.91,126.38 12.91,96.44 5.12,88.65 5.12,50.96 12.1,43.98 13.3,43.98 14.42,45.1 14.42,45.95 v14.74,46.26
  Bottom 0.254: 52.52,35.68 51.18,35.68 v49.98,36.88
  Bottom 0.381: U5.16 57.48,40.64 52.52,35.68 | v38.86,38.66 30.22,47.3 16.74,47.31 15.78,47.31 v14.74,46.26